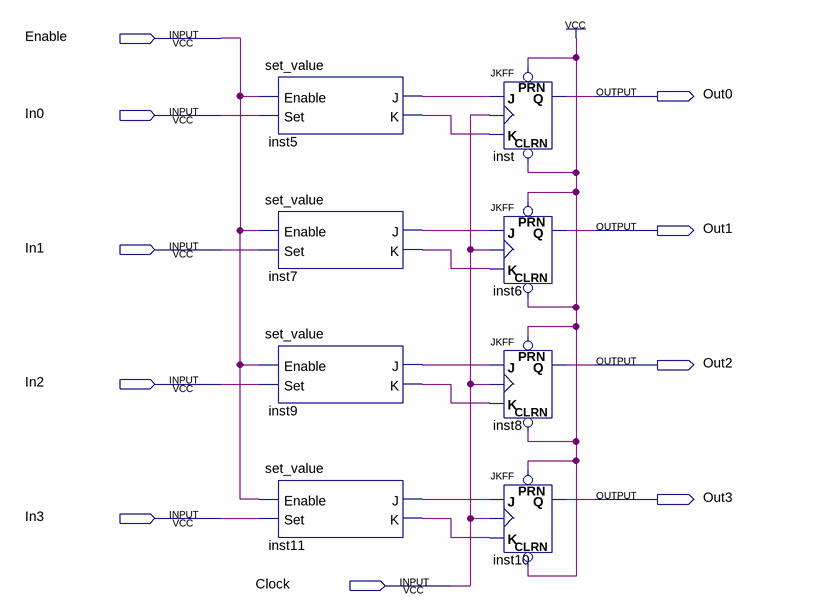
[diagram p0: schematic sheet]
// Quartus schematic 4bit_parallel_register.bdf as structural Verilog: 8 symbols, 10 pins
module \4bit_parallel_register  (
  input  Enable,
  input  In0,
  input  In1,
  input  In2,
  input  In3,
  input  Clock,
  output Out0,
  output Out1,
  output Out2,
  output Out3
);

  wire inst5_j, inst5_k, inst7_j, inst7_k, inst9_j, inst9_k, inst11_j, inst11_k;

  set_value inst5 (.Enable(Enable), .Set(In0), .J(inst5_j), .K(inst5_k));
  set_value inst7 (.Enable(Enable), .Set(In1), .J(inst7_j), .K(inst7_k));
  set_value inst9 (.Enable(Enable), .Set(In2), .J(inst9_j), .K(inst9_k));
  set_value inst11 (.Enable(Enable), .Set(In3), .J(inst11_j), .K(inst11_k));
  JKFF inst (.PRN(1'b1), .CLRN(1'b1), .K(inst5_k), .J(inst5_j), .CLK(Clock), .Q(Out0));
  JKFF inst6 (.PRN(1'b1), .CLRN(1'b1), .K(inst7_k), .J(inst7_j), .CLK(Clock), .Q(Out1));
  JKFF inst8 (.PRN(1'b1), .CLRN(1'b1), .K(inst9_k), .J(inst9_j), .CLK(Clock), .Q(Out2));
  JKFF inst10 (.PRN(1'b1), .CLRN(1'b1), .K(inst11_k), .J(inst11_j), .CLK(Clock), .Q(Out3));
endmodule
